# EasyEDA schematic SCH_DVR8825V5_2024-05-12.json
TITLE: Sheet_1; REV: 1.0; Date: 2024-03-11; Sheet: 1/1; Drawn By: rduart; Company: Your Company
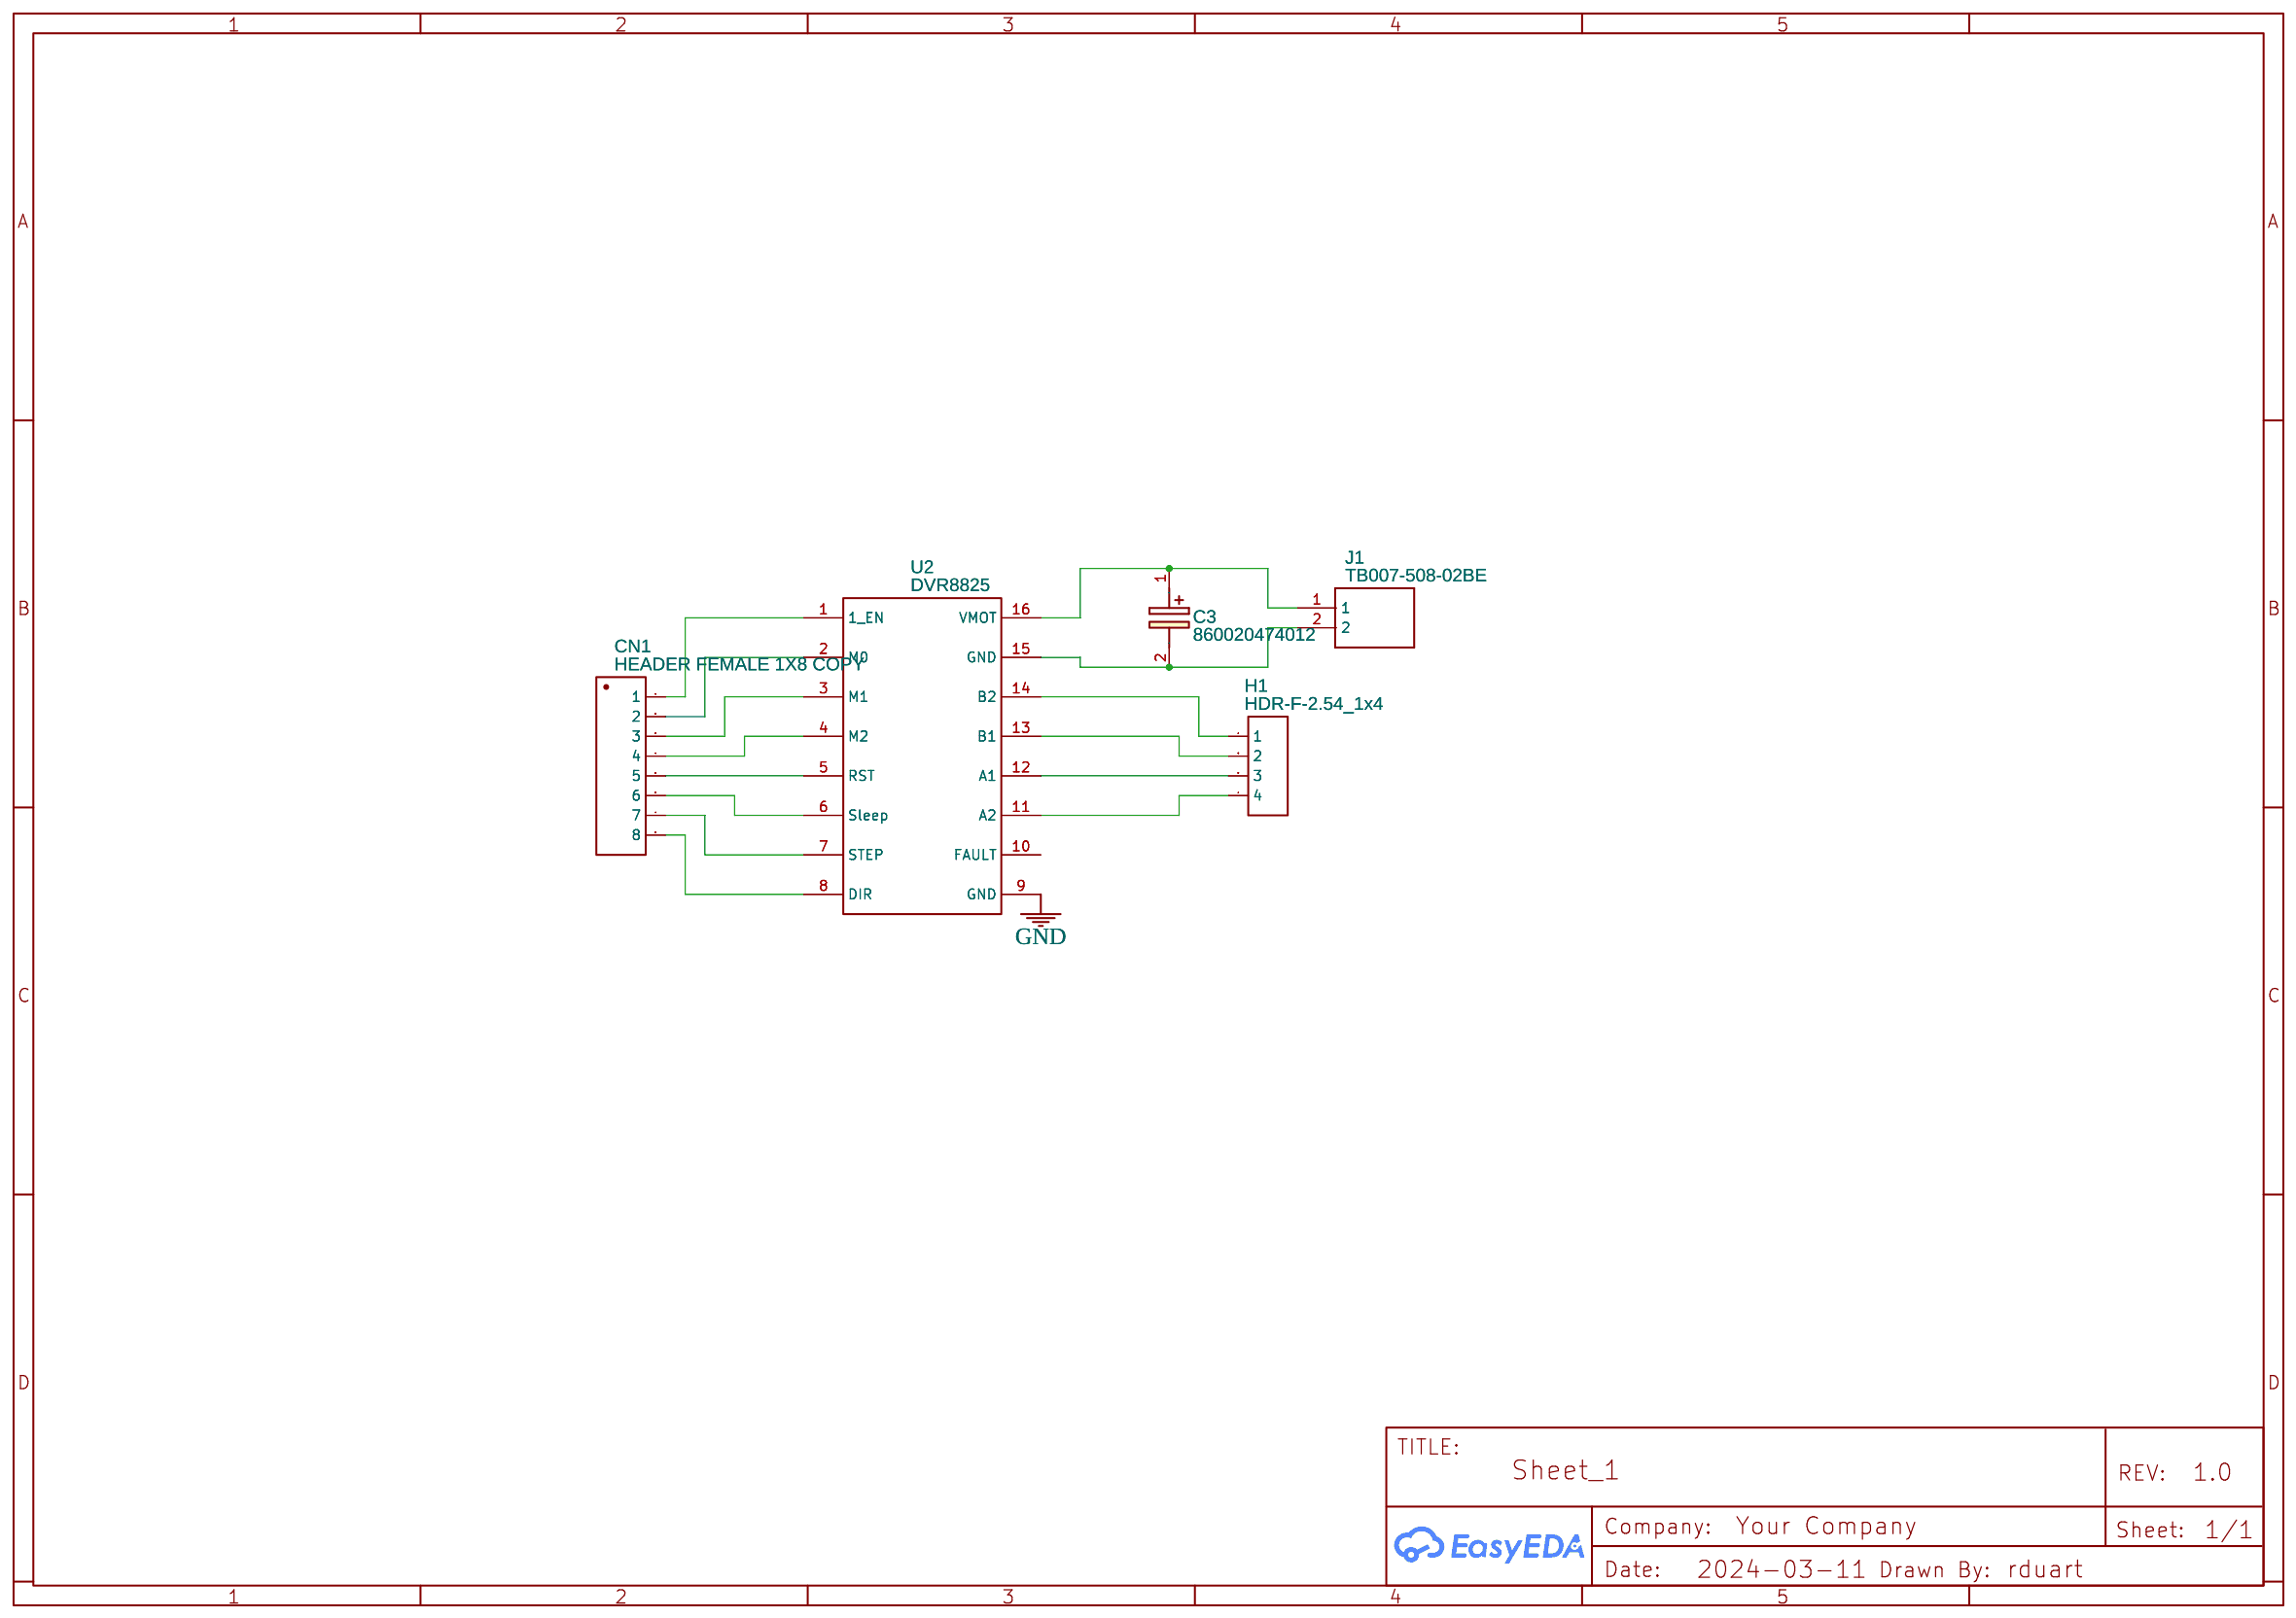
[diagram p0: schematic sheet]

## Parts
C3  860020474012  [CAPPRD350W52D800H1300]
CN1  HEADER FEMALE 1X8 COPY  [HEADER - HEADER-FEMALE-2.54_1X8 ANGELO]
H1  HDR-F-2.54_1x4  [HDR-F-2.54_1X4]
J1  TB007-508-02BE  [CONN-TH_2P-P5.08_CUI_TB007-508-02BE]
U2  DVR8825  [DRV8825/A4988 MODULE MOUNTING HEADER]

## Library data of the parts
C3 = 860020474012
CN1 = HEADER FEMALE 1X8 COPY: Contributor: afmenhem
H1 = HDR-F-2.54_1x4: Supplier Part: C225501; Supplier: LCSC; Contributor: LCEDA_Lib
J1 = TB007-508-02BE
U2 = DVR8825: Manufacturer Part: https://www.pololu.com/product/2133; Contributor: deepan; Supplier Part: https://www.pololu.com/product/2133; Supplier: Pololu; link: https://www.pololu.com/product/2133

## Nets
GND: U2.9(GND)
Net-(C3-1): C3.1(+) J1.1 U2.16(VMOT)
Net-(C3-2): C3.2(-) J1.2 U2.15(GND)
Net-(CN1-1): CN1.1 U2.1(1 EN)
Net-(CN1-2): CN1.2 U2.2(M0)
Net-(CN1-3): CN1.3 U2.3(M1)
Net-(CN1-4): CN1.4 U2.4(M2)
Net-(CN1-5): CN1.5 U2.5(RST)
Net-(CN1-6): CN1.6 U2.6(Sleep)
Net-(CN1-7): CN1.7 U2.7(STEP)
Net-(CN1-8): CN1.8 U2.8(DIR)
Net-(H1-1): H1.1 U2.14(B2)
Net-(H1-2): H1.2 U2.13(B1)
Net-(H1-3): H1.3 U2.12(A1)
Net-(H1-4): H1.4 U2.11(A2)

Not connected (* = marked no-connect by the designer): U2 10(FAULT)
